# EAGLE design Light Siren (EAGLE 9.2.2)
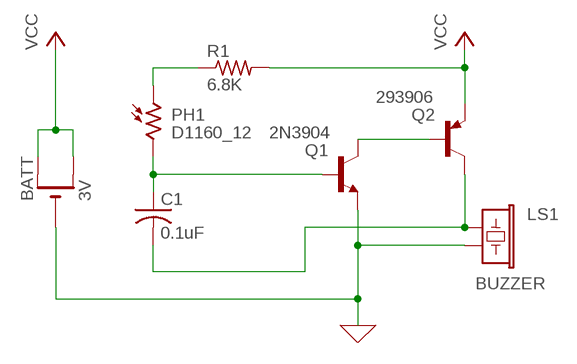
[diagram p0: schematic, sheet 1]

## Parts
BATT  3V  CR1220THM  [CR1220-THM]
C1  0.1uF  C-US025-025X050  [C025-025X050]
LS1  BUZZER  BUZZER-PTH_NO_SILK  [BUZZER-12MM-NS]
PH1  D1160_12  [D11XX]
Q1  2N3904  -NPN-TO92  [TO92]
Q2  293906  -PNP-TO92  [TO92]
R1  6.8K  R-US_0207/10  [0207/10]

## Nets
0: BATT.- LS1.- Q1.1(E) ; supply symbol labelled GND
N$1: PH1.1 R1.1
N$3: C1.2 LS1.+ Q2.3(C)
N$4: Q1.3(C) Q2.2(B)
N$5: C1.1 PH1.2 Q1.2(B)
VCC: BATT.+1(+) BATT.+2(+1) Q2.1(E) R1.2

## Library data of the parts
BATT = adafruit:CR1220: CR1216/CR1220/CR1225 12mm 3V lithium coin cell Great for battery packup. Both SMT and THM holders. Note the THM package has the ground pads on both sides of the PCB so that the masks are the same - this reduces the cost
C1 = rcl:C-US: CAPACITOR, American symbol; SPICEPREFIX: C
LS1 = SparkFun-Electromechanical:BUZZER: Buzzer Small round buzzers that operate around the audible 2kHz range. You can use these as speakers to create simple music or user interfaces. Variant Overview: PTH - Mini Speaker - PC Mount 12mm 2.048kHz <https://www.sparkfun.com/products/7950> PTH_KIT - Mini Speaker - PC Mount 12mm 2.048kHz <https://www.sparkfun.com/products/7950> KIT simplifies soldering by adding stop mask to one side of the pads. PTH_NO_SILK - Mini Speaker - PC Mount 12mm 2.048kHz <https://www.sparkfun.com/products/7950> No silkscreen indicator of buzzer outline. PTH_KIT_NO_SILK - Mini Speaker - PC Mount 12mm 2.048kHz <https://www.sparkfun.com/products/7950> KIT package w/o silkscreen SMD - Buzzer Audio Magnetic (CCV-084B16) SMD buzzer used on, e.g. the LilyPad Buzzer <https://www.sparkfun.com/products/8463> and RFID USB Reader <https://www.sparkfun.com/products/9963>. SMD_KIT - Buzzer Audio Magnetic (CCV-084B16) SMD Buzzer with elongated pins to make soldering easier. Used on the SparkFun Simon Says - Surface Mount Soldering Kit <https://www.sparkfun.com/products/10935>.; PROD_ID: COMP-08253; SF_SKU: COM-07950
PH1 = photo-elements:D11: Photo Sensor Oil Burner Control Applications Source: http://optoelectronics.perkinelmer.com/content/Datasheets/DTS_PhotocellsD1160.pdf
Q1 = transistor:*-NPN-: NPN Transistror BF959 corrected 2008.03.06
Q2 = transistor:*-PNP-: PNP Transistror
R1 = rcl:R-US_: RESISTOR, American symbol; SPICEPREFIX: R

## Net classes
0 default: width 0.305 mm, drill 0.508 mm, clearance 0.508 mm

## Board
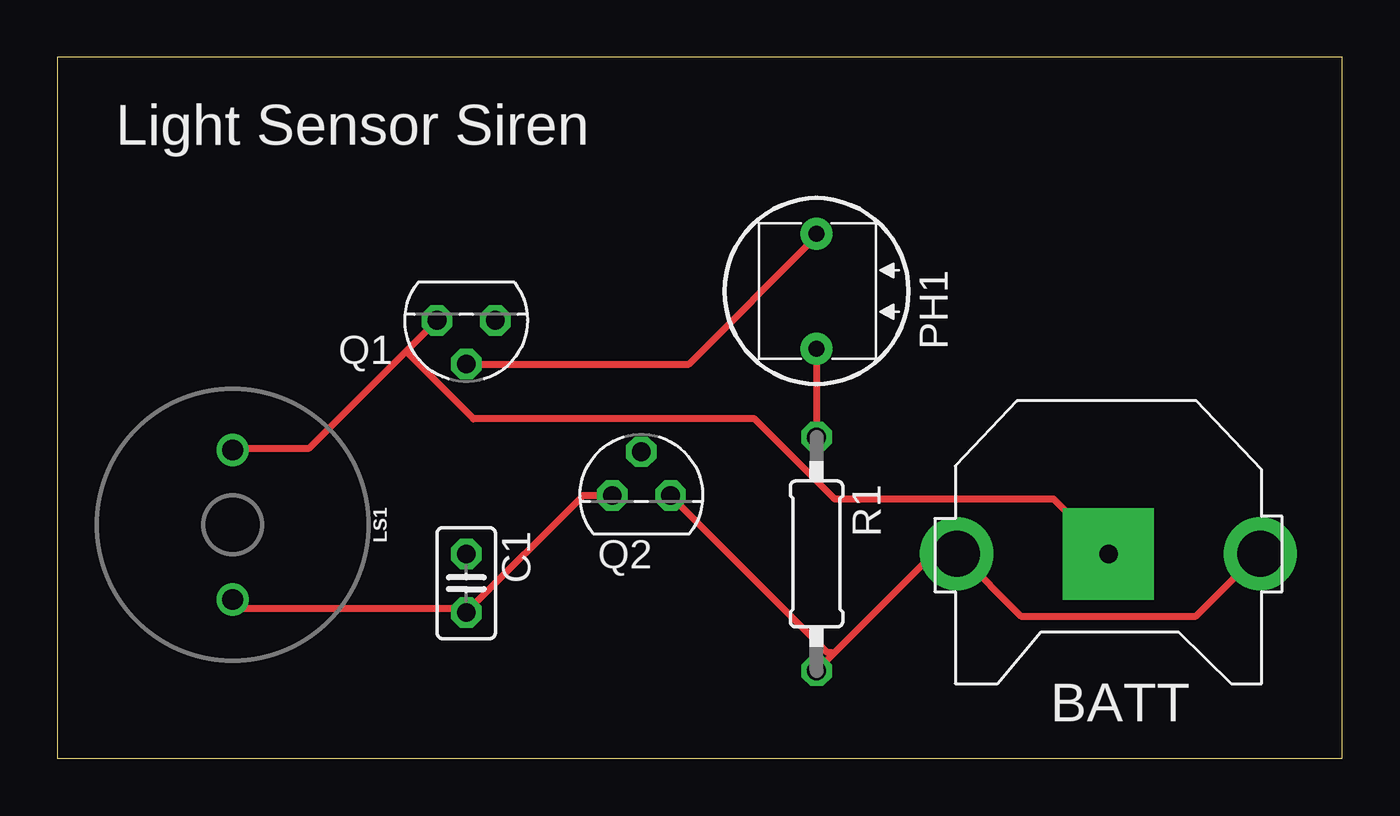
[diagram p1: board, top side]
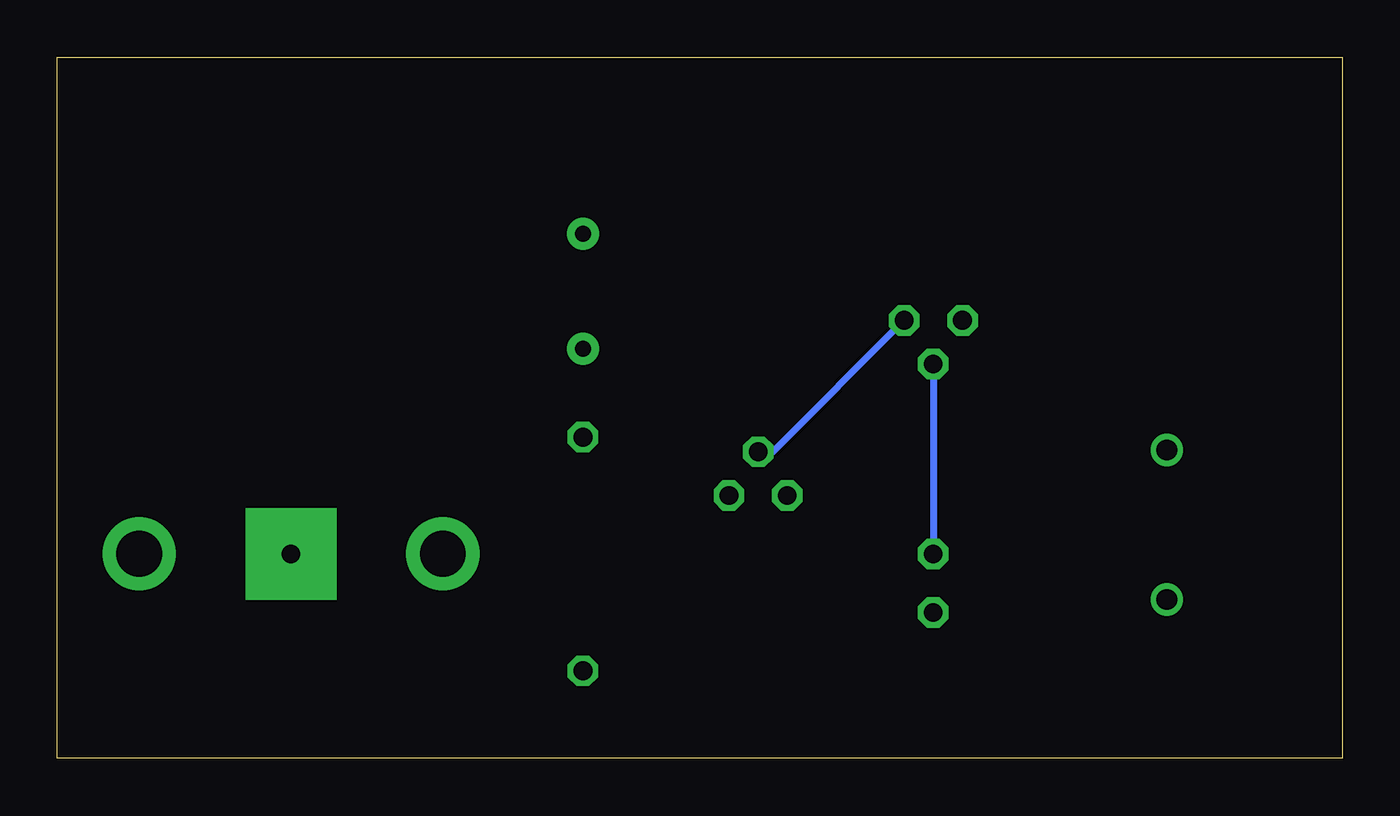
[diagram p2: board, bottom side, seen from below]

Size 55.88 x 30.48 mm. Coordinates in mm from the lower left corner, seen from the top.
Outline: 0,0 55.88,0 55.88,30.48 0,30.48 0,0
Copper layers (1*16): Top 0.035mm / dielectric 1.5mm / Bottom 0.035mm
Design rules "default": minimum track width 6mil, minimum drill 0.35mm, track to track 6mil, track to pad 6mil, pad to pad 6mil, via to via 6mil, smd to smd 6mil, copper to edge 40mil, drill to drill 6mil, minimum pad ring 10mil, minimum via ring 8mil, stop-mask expansion 4mil, vias tented up to drill 0mil, thermal gap 10mil

### Footprints (pad centres in the part's own frame; a part is rotated, then mirrored left to right if it is on the bottom)
CR1220-THM = drill 2 pad 3.175: +1 -6.604,0; +2 6.604,0 | drill 0.8 pad 3.962 square: - 0,0
C025-025X050 = drill 0.813 octagon: 1 -1.27,0; 2 1.27,0
BUZZER-12MM-NS = drill 0.9: + 3.25,0; - -3.25,0
D11XX = drill 0.7 pad 1.4: 1 -2.5,0; 2 2.5,0
TO92 = drill 0.813 octagon: 1 1.27,0; 2 0,1.905; 3 -1.27,0
0207/10 = drill 0.813 octagon: 1 -5.08,0; 2 5.08,0

### Placement (x,y rotation side)
BATT  45.72,8.89 180 top
C1  17.78,7.62 270 top
LS1  7.62,10.16 270 top
PH1  33.02,20.32 90 top
Q1  17.78,19.05 180 top
Q2  25.4,11.43 0 top
R1  33.02,8.89 270 top

### Tracks (layer width: path | path; a pad name or v marks a point on that pad's centre or on a via)
0
  Top 0.305: 15.16,17.7 10.95,13.49 7.62,13.49 LS1.- | 15.16,17.7 Q1.1 | 15.16,17.7 18.1,14.76 30.32,14.76 33.81,11.27 43.34,11.27 BATT.-
N$1
  Top 0.305: PH1.1 R1.1
N$3
  Top 0.305: Q2.3 22.86,11.43 C1.2 17.78,6.51 7.94,6.51 7.62,6.83 LS1.+
N$4
  Bottom 0.305: Q1.3 24.77,13.34 Q2.2
N$5
  Top 0.305: Q1.2 27.46,17.14 33.02,22.7 PH1.2
  Bottom 0.305: Q1.2 C1.1
VCC
  Top 0.305: 33.73,4.52 38.1,8.89 BATT.+2 39.21,8.89 41.91,6.19 49.53,6.19 52.23,8.89 BATT.+1 | 33.73,4.52 R1.2 | Q2.1 33.5,4.6 33.66,4.6 33.73,4.52

### Text on the board
tNames: Light Sensor Siren